# EAGLE design arduino (EAGLE 7.1.0)
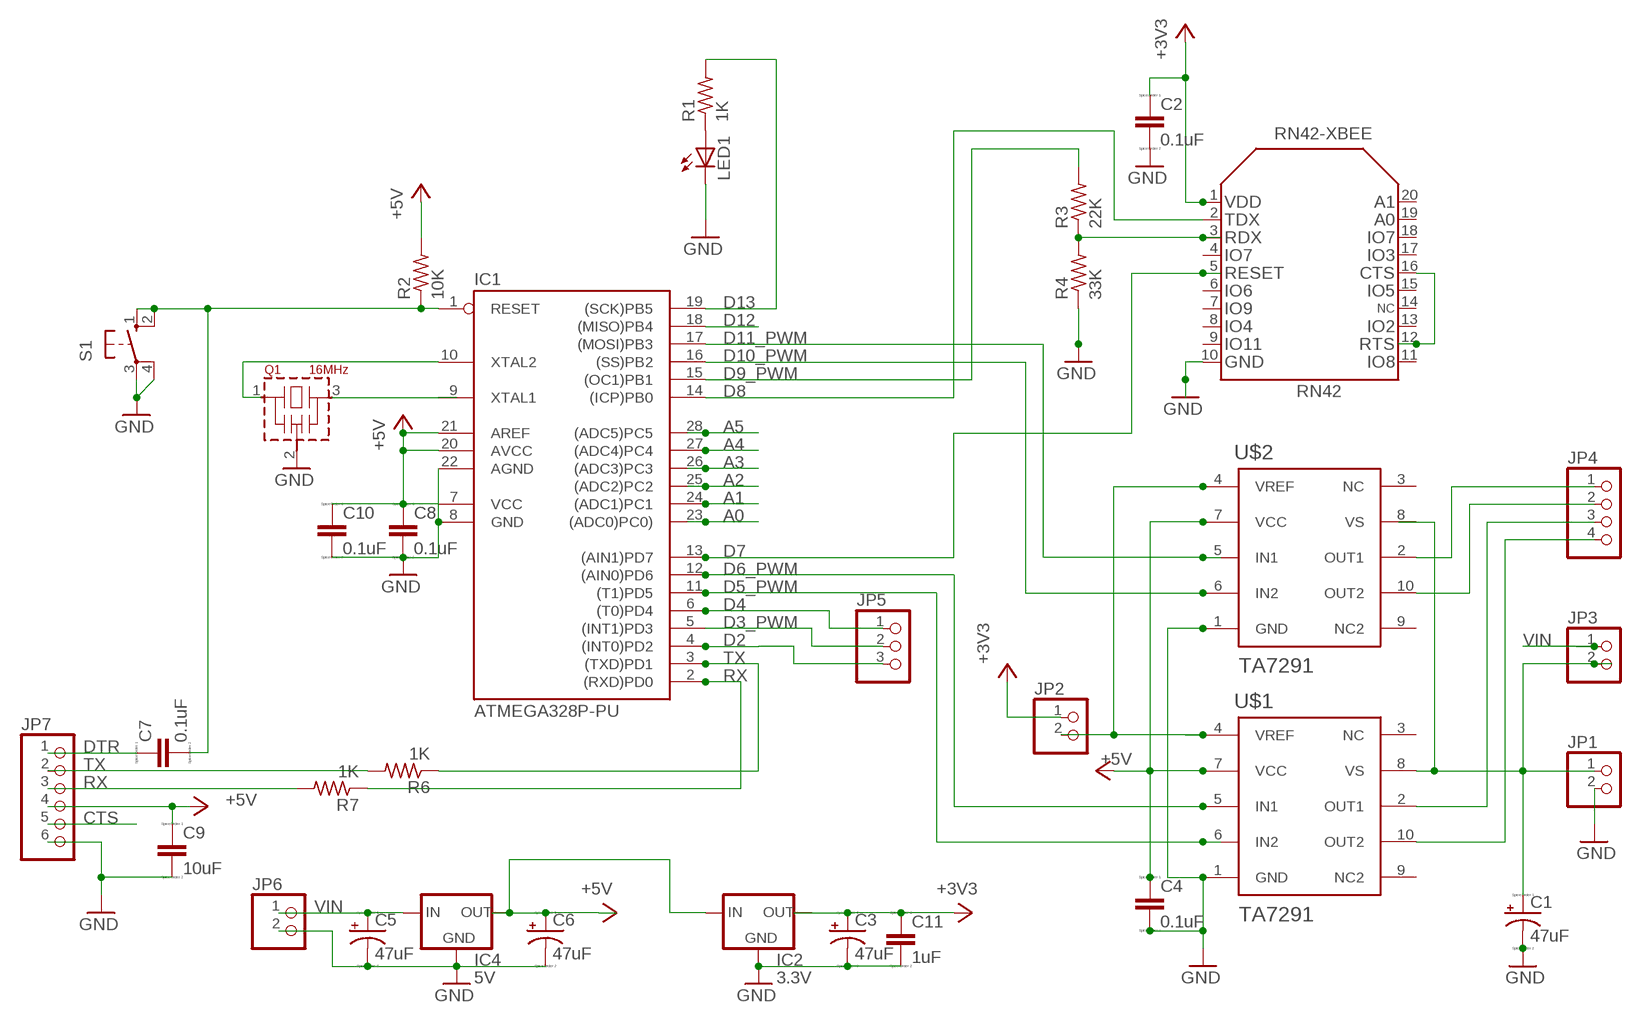
[diagram p0: schematic, sheet 1]

## Parts
C1  47uF  CPOL-USE2-5  [E2-5]
C2  0.1uF  C-EU050-025X075  [C050-025X075]
C3  47uF  CPOL-USE2-5  [E2-5]
C4  0.1uF  C-EU050-025X075  [C050-025X075]
C5  47uF  CPOL-USE2-5  [E2-5]
C6  47uF  CPOL-USE2-5  [E2-5]
C7  0.1uF  C-EU050-025X075  [C050-025X075]
C8  0.1uF  C-EU050-025X075  [C050-025X075]
C9  10uF  C-EU050-025X075  [C050-025X075]
C10  0.1uF  C-EU050-025X075  [C050-025X075]
C11  1uF  C-EU050-025X075  [C050-025X075]
IC1  ATMEGA328P-PU  [DIL28-3]
IC2  3.3V  78XXS  [78XXS]
IC4  5V  78XXS  [78XXS]
JP1  PINHD-1X2  [1X02]
JP2  PINHD-1X2  [1X02]
JP3  PINHD-1X2  [1X02]
JP4  PINHD-1X4  [1X04]
JP5  PINHD-1X3  [1X03]
JP6  PINHD-1X2  [1X02]
JP7  PINHD-1X6  [1X06]
LED1  LED3MM  [LED3MM]
Q1  16MHz  CSTLS_G  [CSTLS_G8]
R1  1K  R-US_0207/10  [0207/10]
R2  10K  R-US_0207/10  [0207/10]
R3  22K  R-US_0207/10  [0207/10]
R4  33K  R-US_0207/10  [0207/10]
R6  1K  R-US_0207/10  [0207/10]
R7  1K  R-US_0207/10  [0207/10]
S1  10-XX  [B3F-10XX]
U$1  TA7291  [HSIP10]
U$2  TA7291  [HSIP10]
U$3  RN42-XBEE  [RN42-XBEE-PKG]

## Nets
+3V3: C2.1 C3.+ C11.1 IC2.OUT JP2.1 U$3.1
+5V: C4.1 C6.+ C8.1 C9.1 C10.1 IC1.7(VCC) IC1.20(AVCC) IC1.21(AREF) IC2.IN IC4.OUT JP7.4 R2.2 U$1.7(VCC) U$2.7(VCC)
A0: IC1.23((ADC0)PC0))
A1: IC1.24((ADC1)PC1)
A2: IC1.25((ADC2)PC2)
A3: IC1.26((ADC3)PC3)
A4: IC1.27((ADC4)PC4)
A5: IC1.28((ADC5)PC5)
CTS: JP7.5
D2: IC1.4((INT0)PD2) JP5.3
D3_PWM: IC1.5((INT1)PD3) JP5.2
D4: IC1.6((T0)PD4) JP5.1
D5_PWM: IC1.11((T1)PD5) U$1.6(IN2)
D6_PWM: IC1.12((AIN0)PD6) U$1.5(IN1)
D7: IC1.13((AIN1)PD7) U$3.5
D8: IC1.14((ICP)PB0) U$3.2
D9_PWM: IC1.15((OC1)PB1) R3.2
D10_PWM: IC1.16((SS)PB2) U$2.6(IN2)
D11_PWM: IC1.17((MOSI)PB3) U$2.5(IN1)
D12: IC1.18((MISO)PB4)
D13: IC1.19((SCK)PB5) R1.2
DTR: C7.1 JP7.1
GND: C1.- C2.2 C3.- C4.2 C5.- C6.- C8.2 C9.2 C10.2 C11.2 IC1.8(GND) IC1.22(AGND) IC2.GND IC4.GND JP1.2 JP6.2 JP7.6 LED1.K(C) Q1.2(VSS) R4.1 S1.3(P) S1.4(P1) U$1.1(GND) U$2.1(GND) U$3.10
N$2: R3.1 R4.2 U$3.3
N$4: JP2.2 U$1.4(VREF) U$2.4(VREF)
N$7: U$3.12 U$3.16
N$8: LED1.A R1.1
N$9: IC1.9(XTAL1) Q1.3
N$10: IC1.10(XTAL2) Q1.1
N$11: JP4.4 U$1.10(OUT2)
N$12: JP7.2 R6.2
N$14: JP7.3 R7.2
N$16: JP4.1 U$2.2(OUT1)
N$102: JP4.2 U$2.10(OUT2)
N$105: JP4.3 U$1.2(OUT1)
RESET: C7.2 IC1.1(RESET) R2.1 S1.1(S) S1.2(S1)
RX: IC1.2((RXD)PD0) R7.1
TX: IC1.3((TXD)PD1) R6.1
VIN: C5.+ IC4.IN JP3.1 JP6.1
VS: C1.+ JP1.1 JP3.2 U$1.8(VS) U$2.8(VS)
Unconnected: U$1.3(NC) U$1.9(NC2) U$2.3(NC) U$2.9(NC2) U$3.4 U$3.6 U$3.7 U$3.8 U$3.9 U$3.11 U$3.13 U$3.14 U$3.15 U$3.17 U$3.18 U$3.19 U$3.20

## Library data of the parts
C1 C3 C5 C6 = resistor:CPOL-US: POLARIZED CAPACITOR, American symbol
C2 C4 C7-C11 = resistor:C-EU: CAPACITOR, European symbol; SPICEPREFIX: C
IC1 = SmartPrj:ATMEGA328P-: MICROCONTROLLER 4 Kbytes FLASH 128 bytes SRAM 256 bytes EEPROM UART 6-channel 10 bit ADC
IC2 IC4 = v-reg:78XXS: VOLTAGE REGULATOR
JP1-JP3 JP6 = pinhead:PINHD-1X2: PIN HEADER
JP4 = pinhead:PINHD-1X4: PIN HEADER
JP5 = pinhead:PINHD-1X3: PIN HEADER
JP7 = pinhead:PINHD-1X6: PIN HEADER
LED1 = led:LED: LED OSRAM: - CHIPLED LG R971, LG N971, LY N971, LG Q971, LY Q971, LO R971, LY R971 LH N974, LH R974 LS Q976, LO Q976, LY Q976 LO Q996 - Hyper CHIPLED LW Q18S LB Q993, LB Q99A, LB R99A - SideLED LS A670, LO A670, LY A670, LG A670, LP A670 LB A673, LV A673, LT A673, LW A673 LH A674 LY A675 LS A676, LA A676, LO A676, LY A676, LW A676 LS A679, LY A679, LG A679 - Hyper Micro SIDELED® LS Y876, LA Y876, LO Y876, LY Y876 LT Y87S - SmartLED LW L88C, LW L88S LB L89C, LB L89S, LG L890 LS L89K, LO L89K, LY L89K LS L896, LA L896, LO L896, LY L896 - TOPLED LS T670, LO T670, LY T670, LG T670, LP T670 LSG T670, LSP T670, LSY T670, LOP T670, LYG T670 LG T671, LOG T671, LSG T671 LB T673, LV T673, LT T673, LW T673 LH T674 LS T676, LA T676, LO T676, LY T676, LB T676, LH T676, LSB T676, LW T676 LB T67C, LV T67C, LT T67C, LS T67K, LO T67K, LY T67K, LW E67C LS E67B, LA E67B, LO E67B, LY E67B, LB E67C, LV E67C, LT E67C LW T67C LS T679, LY T679, LG T679 LS T770, LO T770, LY T770, LG T770, LP T770 LB T773, LV T773, LT T773, LW T773 LH T774 LS E675, LA E675, LY E675, LS T675 LS T776, LA T776, LO T776, LY T776, LB T776 LHGB T686 LT T68C, LB T68C - Hyper Mini TOPLED® LB M676 - Mini TOPLED Santana® LG M470 LS M47K, LO M47K, LY M47K Source: http://www.osram.convergy.de LUXEON: - LUMILED® LXK2-PW12-R00, LXK2-PW12-S00, LXK2-PW14-U00, LXK2-PW14-V00 LXK2-PM12-R00, LXK2-PM12-S00, LXK2-PM14-U00 LXK2-PE12-Q00, LXK2-PE12-R00, LXK2-PE12-S00, LXK2-PE14-T00, LXK2-PE14-U00 LXK2-PB12-K00, LXK2-PB12-L00, LXK2-PB12-M00, LXK2-PB14-N00, LXK2-PB14-P00, LXK2-PB14-Q00 LXK2-PR12-L00, LXK2-PR12-M00, LXK2-PR14-Q00, LXK2-PR14-R00 LXK2-PD12-Q00, LXK2-PD12-R00, LXK2-PD12-S00 LXK2-PH12-R00, LXK2-PH12-S00 LXK2-PL12-P00, LXK2-PL12-Q00, LXK2-PL12-R00 Source: www.luxeon.com KINGBRIGHT: KA-3528ASYC Source: www.kingbright.com
Q1 = murata-resonators:CSTLS_G: Ceramic resonator 2.00 to 10.00 MHz
R1-R4 R6 R7 = resistor:R-US_: RESISTOR, American symbol
S1 = switch-omron:10-XX: OMRON SWITCH; MPN: B3F-1000; OC_FARNELL: 176432; OC_NEWARK: 36M3542
U$1 U$2 = TA7291P:TA7291
U$3 = RN42:RN42-XBEE

## Net classes
0 default: clearance 0.205 mm

## Board
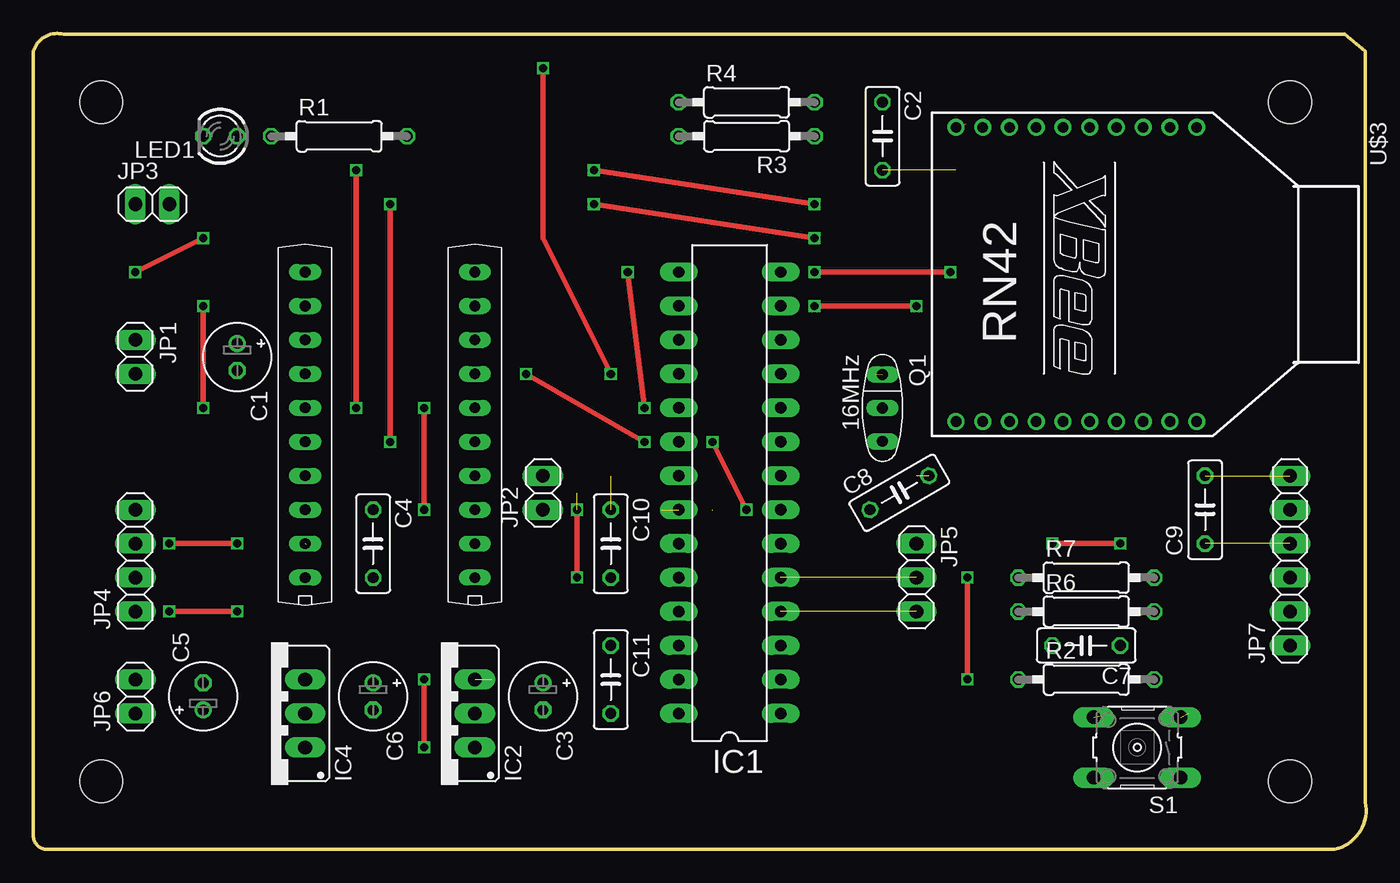
[diagram p1: board, top side]
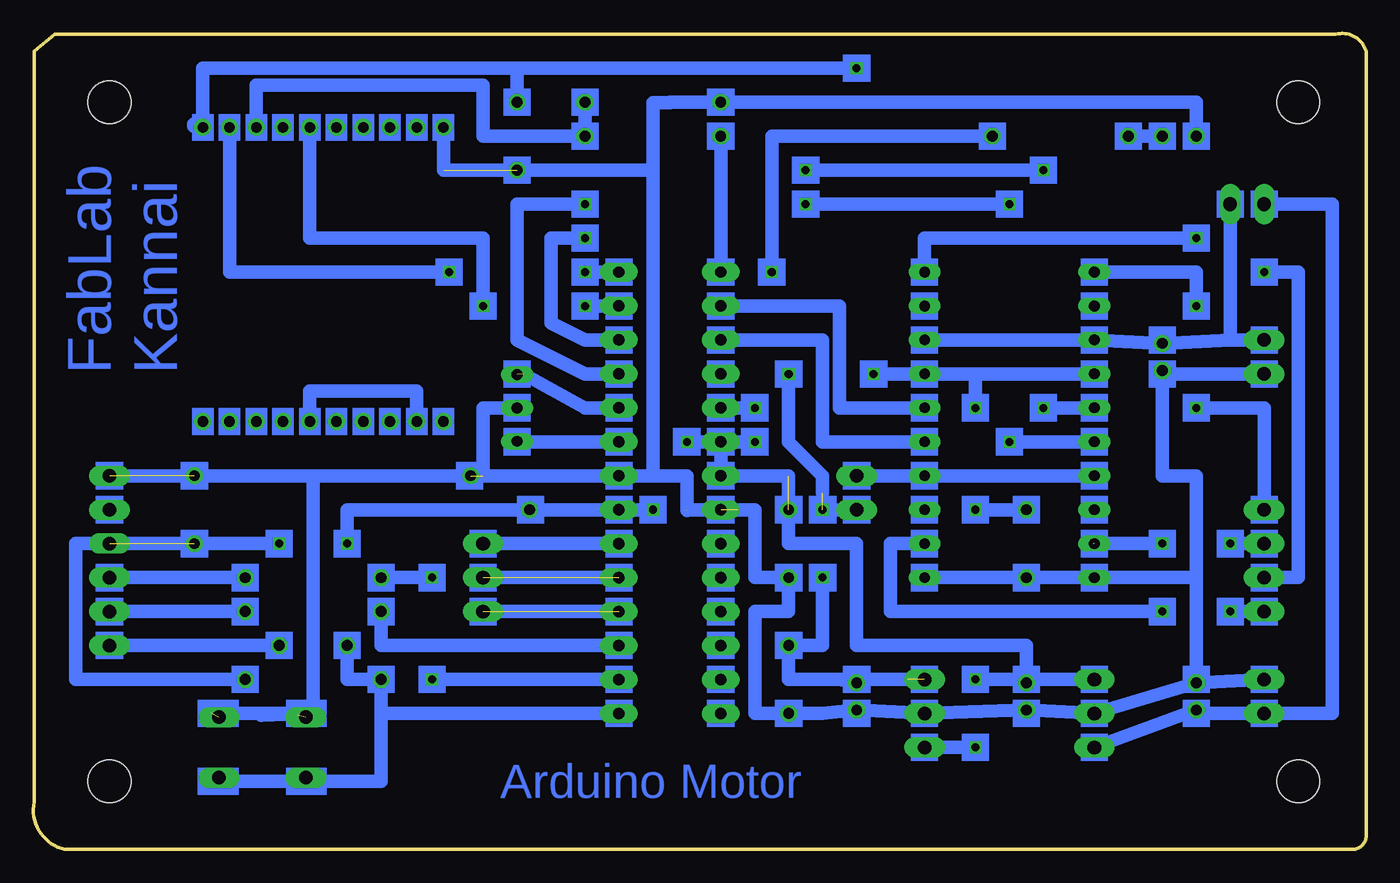
[diagram p2: board, bottom side, seen from below]

Size 99.67 x 61.03 mm. Coordinates in mm from the lower left corner, seen from the top.
Outline: 98.08,60.96 99.6,59.71 99.6,3.54 arc-90 97.33,0 1,0 arc-90 0,1 0,59.69 arc-90 2.27,60.96 98.08,60.96
Copper layers (1*16): Top 0.035mm / dielectric 1.53mm / Bottom 0.035mm
Design rules "pban_4mil-l2": minimum track width 0.1mm, minimum drill 0.3mm, track to track 0.1mm, track to pad 0.229mm, pad to pad 0.1mm, via to via 0.1mm, smd to smd 0.1mm, copper to edge 0.5mm, drill to drill 0.5mm, minimum pad ring 0.15mm, minimum via ring 0.15mm, stop-mask expansion 4mil, vias tented up to drill 0.35mm, thermal gap 10mil
Holes 3.2 mm at 5.08,55.88 5.08,5.08 93.98,5.08 93.98,55.88

### Footprints (pad centres in the part's own frame; a part is rotated, then mirrored left to right if it is on the bottom)
E2-5 = drill 0.813 pad 1.27: + -1.016,0 | drill 0.813 pad 1.27 octagon: - 1.016,0
C050-025X075 = drill 0.813 octagon: 1 -2.54,0; 2 2.54,0
DIL28-3 = drill 0.85 pad 1.422 long: 1 -16.51,-3.81; 2 -13.97,-3.81; 3 -11.43,-3.81; 4 -8.89,-3.81; 5 -6.35,-3.81; 6 -3.81,-3.81; 7 -1.27,-3.81; 8 1.27,-3.81; 9 3.81,-3.81; 10 6.35,-3.81; 11 8.89,-3.81; 12 11.43,-3.81; 13 13.97,-3.81; 14 16.51,-3.81; 15 16.51,3.81; 16 13.97,3.81; 17 11.43,3.81; 18 8.89,3.81; 19 6.35,3.81; 20 3.81,3.81; 21 1.27,3.81; 22 -1.27,3.81; 23 -3.81,3.81; 24 -6.35,3.81; 25 -8.89,3.81; 26 -11.43,3.81; 27 -13.97,3.81; 28 -16.51,3.81
78XXS = drill 1.016 long: GND 0,-2.54; IN -2.54,-2.54; OUT 2.54,-2.54
1X02 = drill 1.016 long: 1 -1.27,0; 2 1.27,0
1X04 = drill 1.016 long: 1 -3.81,0; 2 -1.27,0; 3 1.27,0; 4 3.81,0
1X03 = drill 1.016 long: 1 -2.54,0; 2 0,0; 3 2.54,0
1X06 = drill 1.016 long: 1 -6.35,0; 2 -3.81,0; 3 -1.27,0; 4 1.27,0; 5 3.81,0; 6 6.35,0
LED3MM = drill 0.813 octagon: A -1.27,0; K 1.27,0
CSTLS_G8 = drill 0.813 long: 1 -2.5,0; 2 0,0; 3 2.5,0
0207/10 = drill 0.813 octagon: 1 -5.08,0; 2 5.08,0
B3F-10XX = drill 1.016 long: 1 -3.251,2.261; 2 3.251,2.261; 3 -3.251,-2.261; 4 3.251,-2.261
HSIP10 = drill 0.8 long: 1 -11.43,0; 2 -8.89,0; 3 -6.35,0; 4 -3.81,0; 5 -1.27,0; 6 1.27,0; 7 3.81,0; 8 6.35,0; 9 8.89,0; 10 11.43,0
RN42-XBEE-PKG = drill 0.8 pad 1.27: 1 -11,9; 2 -11,7; 3 -11,5; 4 -11,3; 5 -11,1; 6 -11,-1; 7 -11,-3; 8 -11,-5; 9 -11,-7; 10 -11,-9; 11 11,-9; 12 11,-7; 13 11,-5; 14 11,-3; 15 11,-1; 16 11,1; 17 11,3; 18 11,5; 19 11,7; 20 11,9

### Placement (x,y rotation side)
C1  15.24,36.83 270 top
C2  63.5,53.34 270 top
C3  38.1,11.43 270 top
C4  25.4,22.86 270 top
C5  12.7,11.43 90 top
C6  25.4,11.43 270 top
C7  78.74,15.24 180 top
C8  64.77,26.67 30 top
C9  87.63,25.4 90 top
C10  43.18,22.86 270 top
C11  43.18,12.7 270 top
IC1  52.07,26.67 90 top
IC2  30.48,10.16 90 top
IC4  17.78,10.16 90 top
JP1  7.62,36.83 270 top
JP2  38.1,26.67 90 top
JP3  8.89,48.26 0 top
JP4  7.62,21.59 90 top
JP5  66.04,20.32 270 top
JP6  7.62,11.43 90 top
JP7  93.98,21.59 90 top
LED1  13.97,53.34 180 top
Q1  63.5,33.02 270 top
R1  22.86,53.34 0 top
R2  78.74,12.7 0 top
R3  53.34,53.34 180 top
R4  53.34,55.88 0 top
R6  78.74,17.78 0 top
R7  78.74,20.32 0 top
S1  82.55,7.62 180 top
U$1  20.32,31.75 90 top
U$2  33.02,31.75 90 top
U$3  78,43 270 top

### Tracks (layer width: path | path; a pad name or v marks a point on that pad's centre or on a via)
+3V3  (via drill 0.6)  (2 unrouted)
  Top 0.406: v40.64,25.4 v40.64,20.32 | v38.1,58.42 38.1,45.72 v43.18,35.56
  Bottom 1.016: C3.+ 39.37,12.7 | 39.37,12.7 34.29,12.7 | 35.56,12.7 IC2.OUT | U$3.1 87.68,54.24 87.68,54.09 U$3.1 | v40.64,20.32 40.64,15.24 C11.1 43.18,12.7 39.37,12.7 | U$3.1 87,58.42 63.5,58.42 | 63.5,58.42 v38.1,58.42 | v43.18,35.56 43.18,30.48 40.64,27.94 40.64,26.67 | v40.64,25.4 JP2.1 | C2.1 63.5,58.42
+5V  (via drill 0.6)  (2 unrouted)
  Top 0.406: v53.34,25.4 v50.8,30.48 | v81.28,22.86 v76.2,22.86 | v29.21,7.62 v29.21,12.7 | v45.72,30.48 v36.83,35.56 | v29.21,33.02 v29.21,25.4
  Bottom 1.016: IC4.OUT 25.4,12.7 | v29.21,12.7 25.4,12.7 | 25.4,12.7 C6.+ 25.4,15.24 38.1,15.24 38.1,22.86 43.18,22.86 43.18,27.94 IC1.21 IC1.20 | v36.83,35.56 U$2.7 29.21,35.56 | v53.34,25.4 IC1.7 C8.1 | v76.2,22.86 76.2,25.4 C8.1 | v50.8,30.48 IC1.20 | v81.28,22.86 JP7.4 96.52,22.86 96.52,12.7 R2.2 | IC2.IN v29.21,7.62 | IC1.20 v45.72,30.48 | U$1.7 29.21,35.56 | 29.21,35.56 v29.21,33.02 | v29.21,25.4 C4.1 | C8.1 60.96,25.4
D2  (1 unrouted)
  Bottom 1.016: IC1.4 JP5.3
D3_PWM  (1 unrouted)
  Bottom 1.016: 57.15,20.32 JP5.2
D4
  Bottom 1.016: IC1.6 JP5.1
D5_PWM  (via drill 0.6)
  Top 0.406: v58.42,48.26 v41.91,50.8 | v24.13,50.8 v24.13,33.02
  Bottom 1.016: IC1.11 58.42,35.56 63.5,38.1 63.5,48.26 v58.42,48.26 | v41.91,50.8 v24.13,50.8 | v24.13,33.02 U$1.6
D6_PWM  (via drill 0.6)
  Top 0.406: v26.67,30.48 v26.67,48.26 | v41.91,48.26 v58.42,45.72
  Bottom 1.016: U$1.5 v26.67,30.48 | v26.67,48.26 v41.91,48.26 | v58.42,45.72 60.96,45.72 60.96,39.37 58.42,38.1 IC1.12
D7  (via drill 0.6)
  Top 0.406: 58.42,40.66 v58.42,40.64 v66.04,40.64
  Bottom 1.016: v66.04,40.64 66.04,45.72 79,45.72 U$3.5 | v58.42,40.64 IC1.13
D8  (via drill 0.6)
  Top 0.406: v58.42,43.18 v68.58,43.18
  Bottom 1.016: v68.58,43.18 85,43.18 U$3.2 | 58.42,43.26 v58.42,43.18 IC1.14
D9_PWM
  Bottom 1.016: R3.2 IC1.15
D10_PWM
  Bottom 1.016: U$2.6 39.37,33.02 39.37,40.64 IC1.16
D11_PWM
  Bottom 1.016: IC1.17 40.64,38.1 40.64,30.48 U$2.5 32.84,30.45
D13  (via drill 0.6)
  Top 0.406: v44.45,43.18 v45.72,33.02
  Bottom 1.016: R1.2 44.45,53.34 v44.45,43.18 | IC1.19 v45.72,33.02
DTR
  Bottom 1.016: C7.1 JP7.1
GND  (7 unrouted)
  Top 0.1: 69.69,54.24 U$3.10 | 33.14,20.38 U$2.1
  Bottom 1.016: JP1.2 15.24,35.56 C1.- 15.24,27.94 12.7,27.94 12.7,20.32 | C5.- 12.7,20.32 | JP6.2 C5.- | C5.- IC4.GND C6.- IC2.GND C3.- 40.64,10.16 C11.2 45.72,10.16 45.72,17.78 43.18,17.78 C10.2 45.72,20.32 45.72,25.4 46.99,25.4 | U$3.10 69,50.8 53.34,50.8 | 53.34,27.94 50.8,27.94 50.8,25.4 IC1.22 48.34,25.26 | 53.34,27.94 IC1.8 66.04,27.94 | 53.34,27.94 53.34,50.8 | 53.34,50.8 53.34,55.86 52.07,55.86 52.07,55.88 R4.1 12.7,55.88 LED1.K | JP7.6 78.74,27.94 | 78.74,27.94 66.04,27.94 | 66.04,27.94 66.04,33.02 Q1.2 | 80.01,10.16 78.74,10.16 | 78.74,10.16 78.74,27.94 | 50.78,25.36 50.8,25.36 | 79.9,10.01 80.01,10.16 | 82.65,10.01 78.74,10.16 | JP1.2 7.72,35.63 8.18,35.63 JP1.2 | 80.01,10.16 86.36,10.16 | U$2.1 C4.2 U$1.1 12.7,20.32
N$2
  Bottom 1.016: R4.2 R3.1 66.04,53.34 66.04,57.15 83,57.15 U$3.3
N$4
  Bottom 1.016: U$1.4 U$2.4 JP2.2
N$7
  Bottom 1.016: U$3.12 71,34.29 79,34.29 U$3.16
N$8
  Bottom 1.016: R1.1 LED1.A
N$9
  Bottom 1.016: IC1.9 63.5,30.48 63.59,30.6 Q1.3
N$10  (1 unrouted)
  Bottom 1.016: IC1.10 58.42,33.02 62.99,35.56
N$11  (via drill 0.6)
  Top 0.406: v12.7,40.64 v12.7,33.02
  Bottom 1.016: U$1.10 12.7,43.18 v12.7,40.64 | v12.7,33.02 7.62,33.02 JP4.4
N$12
  Bottom 1.016: R6.2 JP7.2
N$14
  Bottom 1.016: R7.2 JP7.3
N$16  (via drill 0.6)
  Top 0.406: v15.24,17.78 v10.16,17.78
  Bottom 1.016: U$2.2 35.56,22.86 35.56,17.78 v15.24,17.78 | v10.16,17.78 JP4.1
N$102  (via drill 0.6)
  Top 0.406: v12.7,45.72 v7.62,43.18
  Bottom 1.016: U$2.10 33.02,45.72 v12.7,45.72 | v7.62,43.18 5.08,43.18 5.08,20.32 JP4.2
N$105  (via drill 0.6)  (1 unrouted)
  Top 0.1: 20.38,22.82 20.38,22.86
  Top 0.406: v15.24,22.86 v10.16,22.86
  Bottom 1.016: U$1.2 v15.24,22.86 | v10.16,22.86 JP4.3
RESET
  Bottom 1.016: IC1.1 73.66,10.16 | IC1.1 55.96,10.16 57.03,10.16 IC1.1 | C7.2 76.2,12.7 R2.1 73.66,10.16 | 73.66,10.16 73.66,5.08 79.44,5.08 | 79.44,5.08 85.7,5.08 | 85.7,5.08 86.36,5.08 | 79.44,5.08 79.44,5.29 S1.2 | 85.7,5.08 85.7,5.29 S1.1
RX  (via drill 0.6)
  Top 0.406: v69.85,12.7 v69.85,20.32
  Bottom 1.016: IC1.2 v69.85,12.7 | v69.85,20.32 R7.1
TX
  Bottom 1.016: IC1.3 73.66,15.24 R6.1
VIN
  Bottom 1.016: JP3.1 2.54,48.26 2.54,10.16 JP6.1 12.7,10.16 C5.+ IC4.IN
VS
  Bottom 1.016: U$2.8 U$1.8 C1.+ 10.16,38.1 | 10.16,38.1 JP1.1 | JP3.2 10.16,38.1
(copper drawn outside any net)
  shapes: Bottom area x177

### Text on the board
Bottom: FabLab / Kannai | Arduino Motor